# EAGLE design DMX-B (EAGLE 6.4)
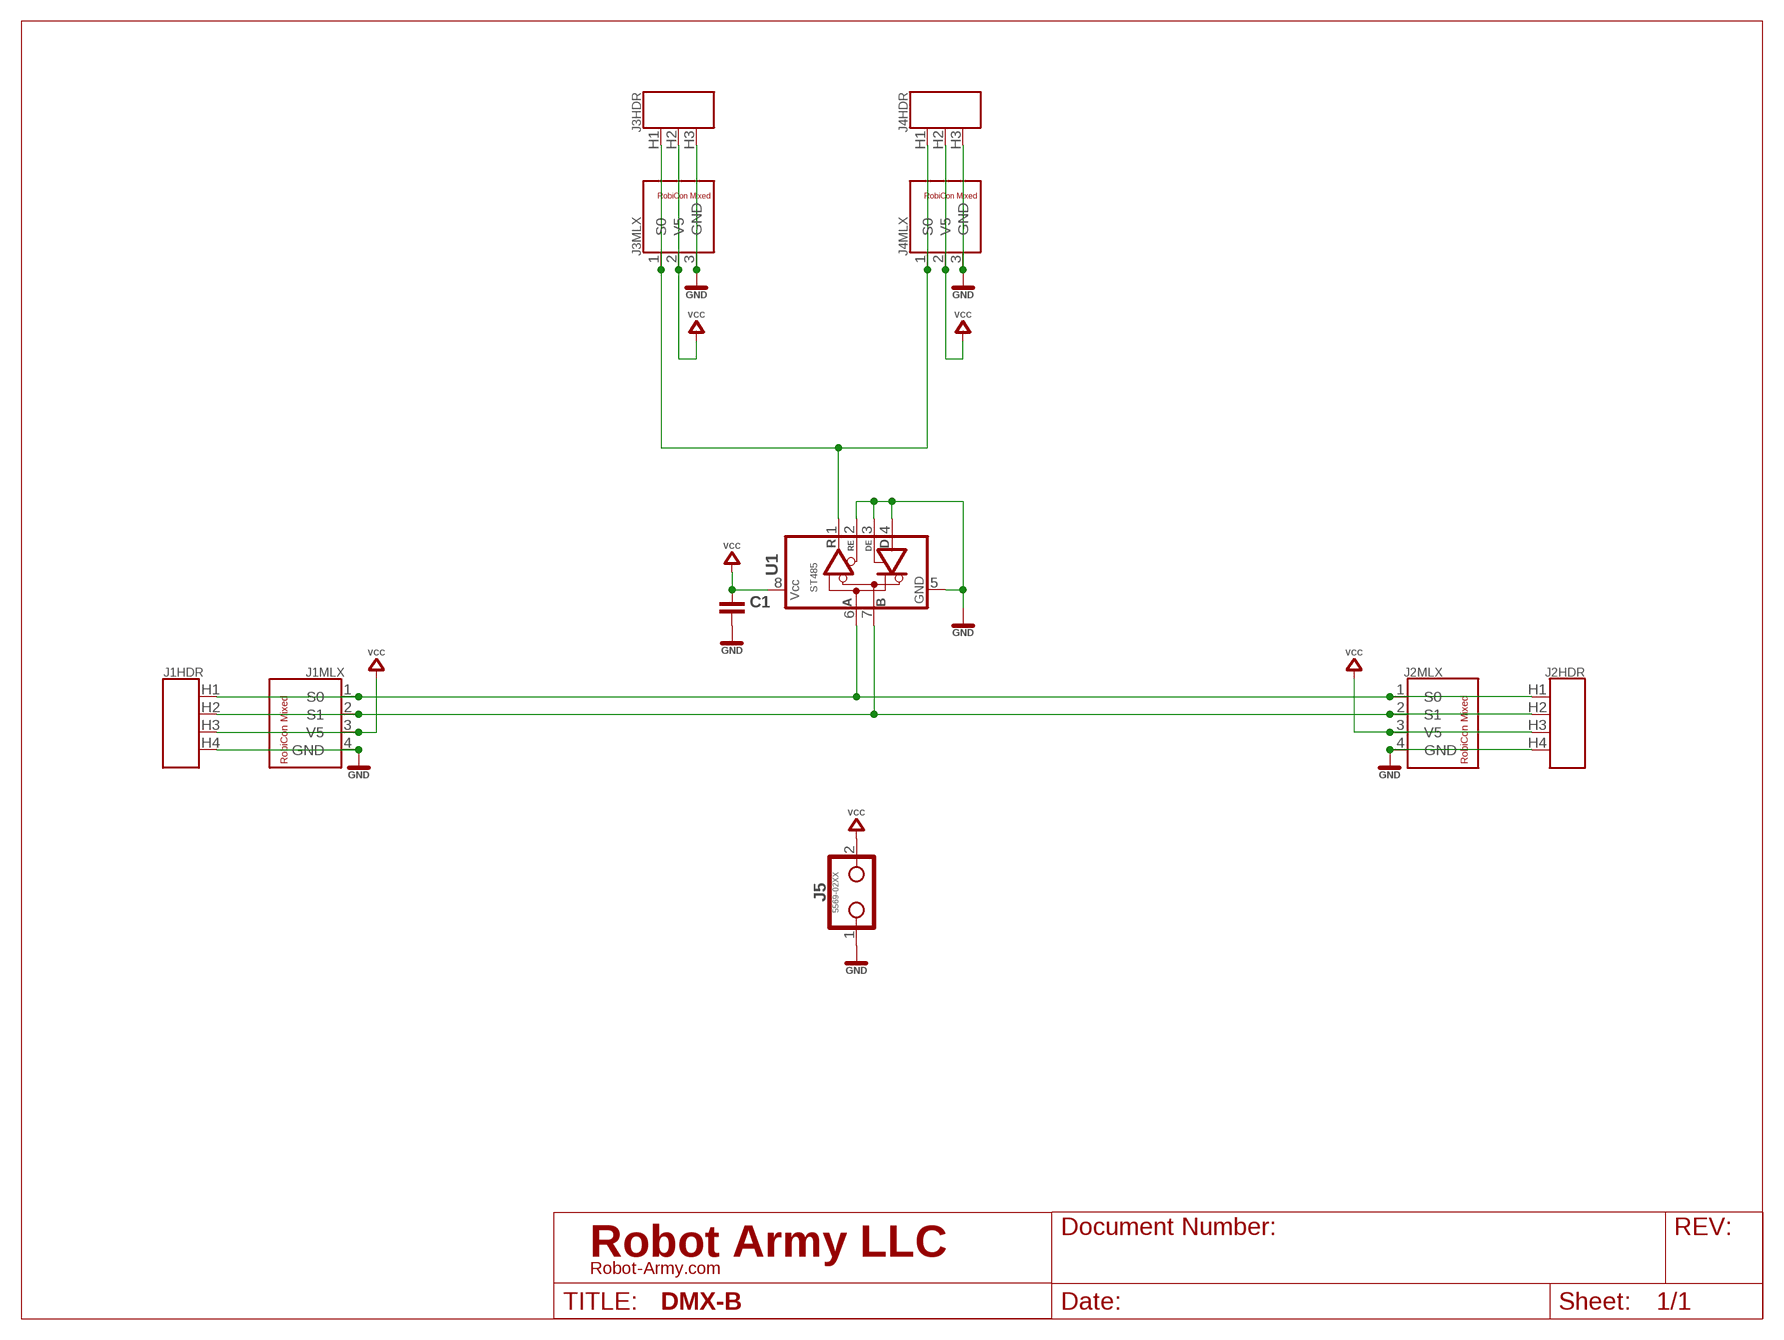
[diagram p0: schematic, sheet 1]
U$1 (LETTER_L-LIGHTPLAY): REV: A

## Parts
C1  CAPACITOR0603  [0603]
J1  ROBICON_M_04P_DUAL  [ROBICON-DUAL-04P]
J2  ROBICON_M_04P_DUAL  [ROBICON-DUAL-04P]
J3  ROBICON_M_03P_DUAL  [ROBICON-DUAL-03P]
J4  ROBICON_M_03P_DUAL  [ROBICON-DUAL-03P]
J5  5569-02XX  MINIFIT-JR-02P-RA  [MOLEX-5569-02XX]
U1  ST485  RS485_TRANSCEIVERSO8  [SOP08]

## Nets
GND: C1.2 J1.4(MLX:GND) J1.H4 J2.4(MLX:GND) J2.H4 J3.3(MLX:GND) J3.H3 J4.3(MLX:GND) J4.H3 J5.1 U1.2(RE) U1.3(DE) U1.4(D) U1.5(GND)
N$3: J1.1(MLX:S0) J1.H1 J2.1(MLX:S0) J2.H1 U1.6(A)
N$4: J1.2(MLX:S1) J1.H2 J2.2(MLX:S1) J2.H2 U1.7(B)
N$5: J3.1(MLX:S0) J3.H1 J4.1(MLX:S0) J4.H1 U1.1(R)
VCC: C1.1 J1.3(MLX:V5) J1.H3 J2.3(MLX:V5) J2.H3 J3.2(MLX:V5) J3.H2 J4.2(MLX:V5) J4.H2 J5.2 U1.8(VCC)

## Library data of the parts
C1 = rlc:CAPACITOR: Capacitor CAP
J1 J2 = robicon-connectors-m:ROBICON_M_04P_DUAL
J3 J4 = robicon-connectors-m:ROBICON_M_03P_DUAL
J5 = con-molex:MINIFIT-JR-02P: MiniFit Jr. 2-pin
U1 = logic:RS485_TRANSCEIVER: RS485 TRANSEIVER

## Board
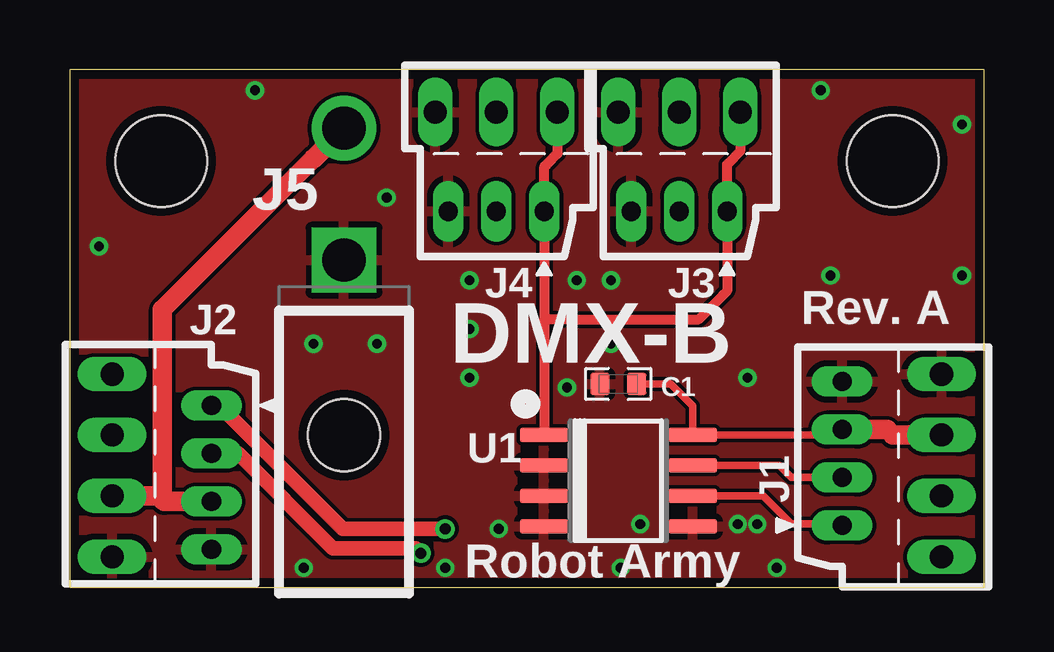
[diagram p1: board, top side]
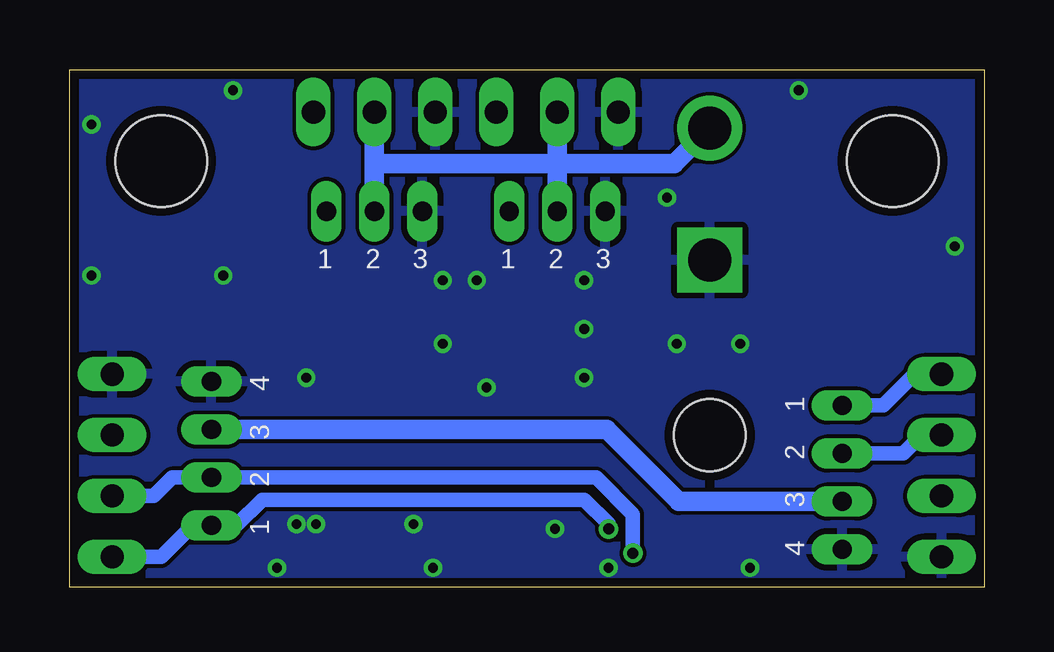
[diagram p2: board, bottom side, seen from below]

Size 38.1 x 21.59 mm. Coordinates in mm from the lower left corner, seen from the top.
Outline: 0,0 38.1,0 38.1,21.59 0,21.59 0,0
Copper layers (1*16): Top 0.0356mm / dielectric 1.5011mm / Bottom 0.0356mm
Design rules "OSH-CircuitMonkey *": minimum track width 6mil, minimum drill 13mil, track to track 6mil, track to pad 6mil, pad to pad 6mil, via to via 6mil, smd to smd 6mil, copper to edge 15mil, drill to drill 6mil, minimum pad ring 7mil, minimum via ring 7mil, stop-mask expansion 3mil, vias tented up to drill 18mil, thermal gap 10mil
Holes 3.81 mm at 3.81,17.78 34.29,17.78

### Footprints (pad centres in the part's own frame; a part is rotated, then mirrored left to right if it is on the bottom)
0603 = smd 0.8 x 0.9: 1 -0.763,0; 2 0.763,0
ROBICON-DUAL-04P = drill 0.8 pad 1.27 long: 1 2.1,2.5; 2 2.1,0.5; 3 2.1,-1.5; 4 2.1,-3.5 | drill 0.965 pad 1.27 long: H1 -2.04,3.81; H2 -2.04,1.27; H3 -2.04,-1.27; H4 -2.04,-3.81
ROBICON-DUAL-03P = drill 0.8 pad 1.27 long: 1 2.1,2; 2 2.1,0; 3 2.1,-2 | drill 0.965 pad 1.27 long: H1 -2.04,2.54; H2 -2.04,0; H3 -2.04,-2.54
MOLEX-5569-02XX = drill 1.8 square: 1 0,7.3 | drill 1.8: 2 0,12.8 | hole 3: 0,0
SOP08 = smd 0.6 x 2: 1 -1.905,-3.1; 2 -0.635,-3.1; 3 0.635,-3.1; 4 1.905,-3.1; 5 1.905,3.1; 6 0.635,3.1; 7 -0.635,3.1; 8 -1.905,3.1

### Placement (x,y rotation side)
C1  22.86,8.48 180 top
J1  34.29,5.08 180 top
J2  3.81,5.08 0 top
J3  25.4,17.78 270 top
J4  17.78,17.78 270 top
J5  11.43,6.35 0 top
U1  22.86,4.45 270 top

### Tracks (layer width: path | path; a pad name or v marks a point on that pad's centre or on a via)
GND  (via drill 0.41)
  other vias: 37.19,13 31.7,13 28.24,8.74 37.19,19.3 31.29,20.73 22.56,10.16 22.56,12.8 20.73,8.33 16.66,8.74 16.66,10.77 15.65,0.81 17.88,2.44 27.84,2.64 28.65,2.64 23.77,2.64 22.96,0.81 29.46,0.81 9.75,0.81 10.16,10.16 12.8,10.16 13.21,16.26 7.72,20.73 1.22,14.22 16.66,12.8 21.13,12.8
  pour Top: 0,0 38.1,0 38.1,21.59 0,21.59
  pour Bottom: 0,0 38.1,0 38.1,21.59 0,21.59
N$3  (via drill 0.46)
  Top 0.305: U1.6 28.91,3.81 30.07,2.64 32.13,2.64 J1.1
  Top 0.61: J2.1 6.24,7.58 11.38,2.44 v15.65,2.44
  Bottom 0.61: J1.H1 34.29,1.27 32.98,2.58 J1.1 31.15,2.58 30.07,3.66 16.66,3.66 15.65,2.64 v15.65,2.44 | J2.H1 2.9,8.89 4.21,7.58 J2.1
N$4  (via drill 0.46)
  Top 0.305: U1.7 29.57,5.08 30.07,4.58 J1.2
  Top 0.61: J2.2 7.02,5.58 10.97,1.63 14.43,1.63 v14.63,1.42
  Bottom 0.61: J1.H2 34.59,3.81 33.83,4.58 J1.2 16.16,4.58 14.63,3.05 v14.63,1.42 | J2.H2 2.59,6.35 3.36,5.58 J2.2
N$5
  Top 0.406: J4.H1 20.32,18.09 19.91,17.68 19.78,17.55 J4.1 19.78,12.12 19.78,11.18 | J3.H1 27.94,18.19 27.43,17.68 27.4,17.65 J3.1 27.4,12.36 27.23,12.19 26.21,11.18 20.73,11.18 19.78,11.18 | 19.78,11.18 19.78,6.37 U1.1
VCC
  Top 0.305: J1.3 31.96,6.35 U1.8 25.96,7.57 25.04,8.48 C1.1
  Top 0.813: J2.H3 3.71,3.81 3.86,3.66 | J2.3 3.94,3.58 3.86,3.66 | J1.H3 34.29,6.35 34.06,6.58 J1.3 | 3.86,3.66 3.86,11.58 10.16,17.88 J5.2
  Bottom 0.813: J1.3 15.72,6.58 12.72,3.58 J2.3 | J5.2 12.9,17.68 17.78,17.68 | J3.H2 25.4,17.68 | 25.4,17.68 J3.2 | J4.H2 17.78,17.68 | 17.78,17.68 J4.2 | 17.78,17.68 25.4,17.68 | 2.79,3.81 J2.H3

### Text on the board
tPlace: Rev. A | DMX-B | Robot Army